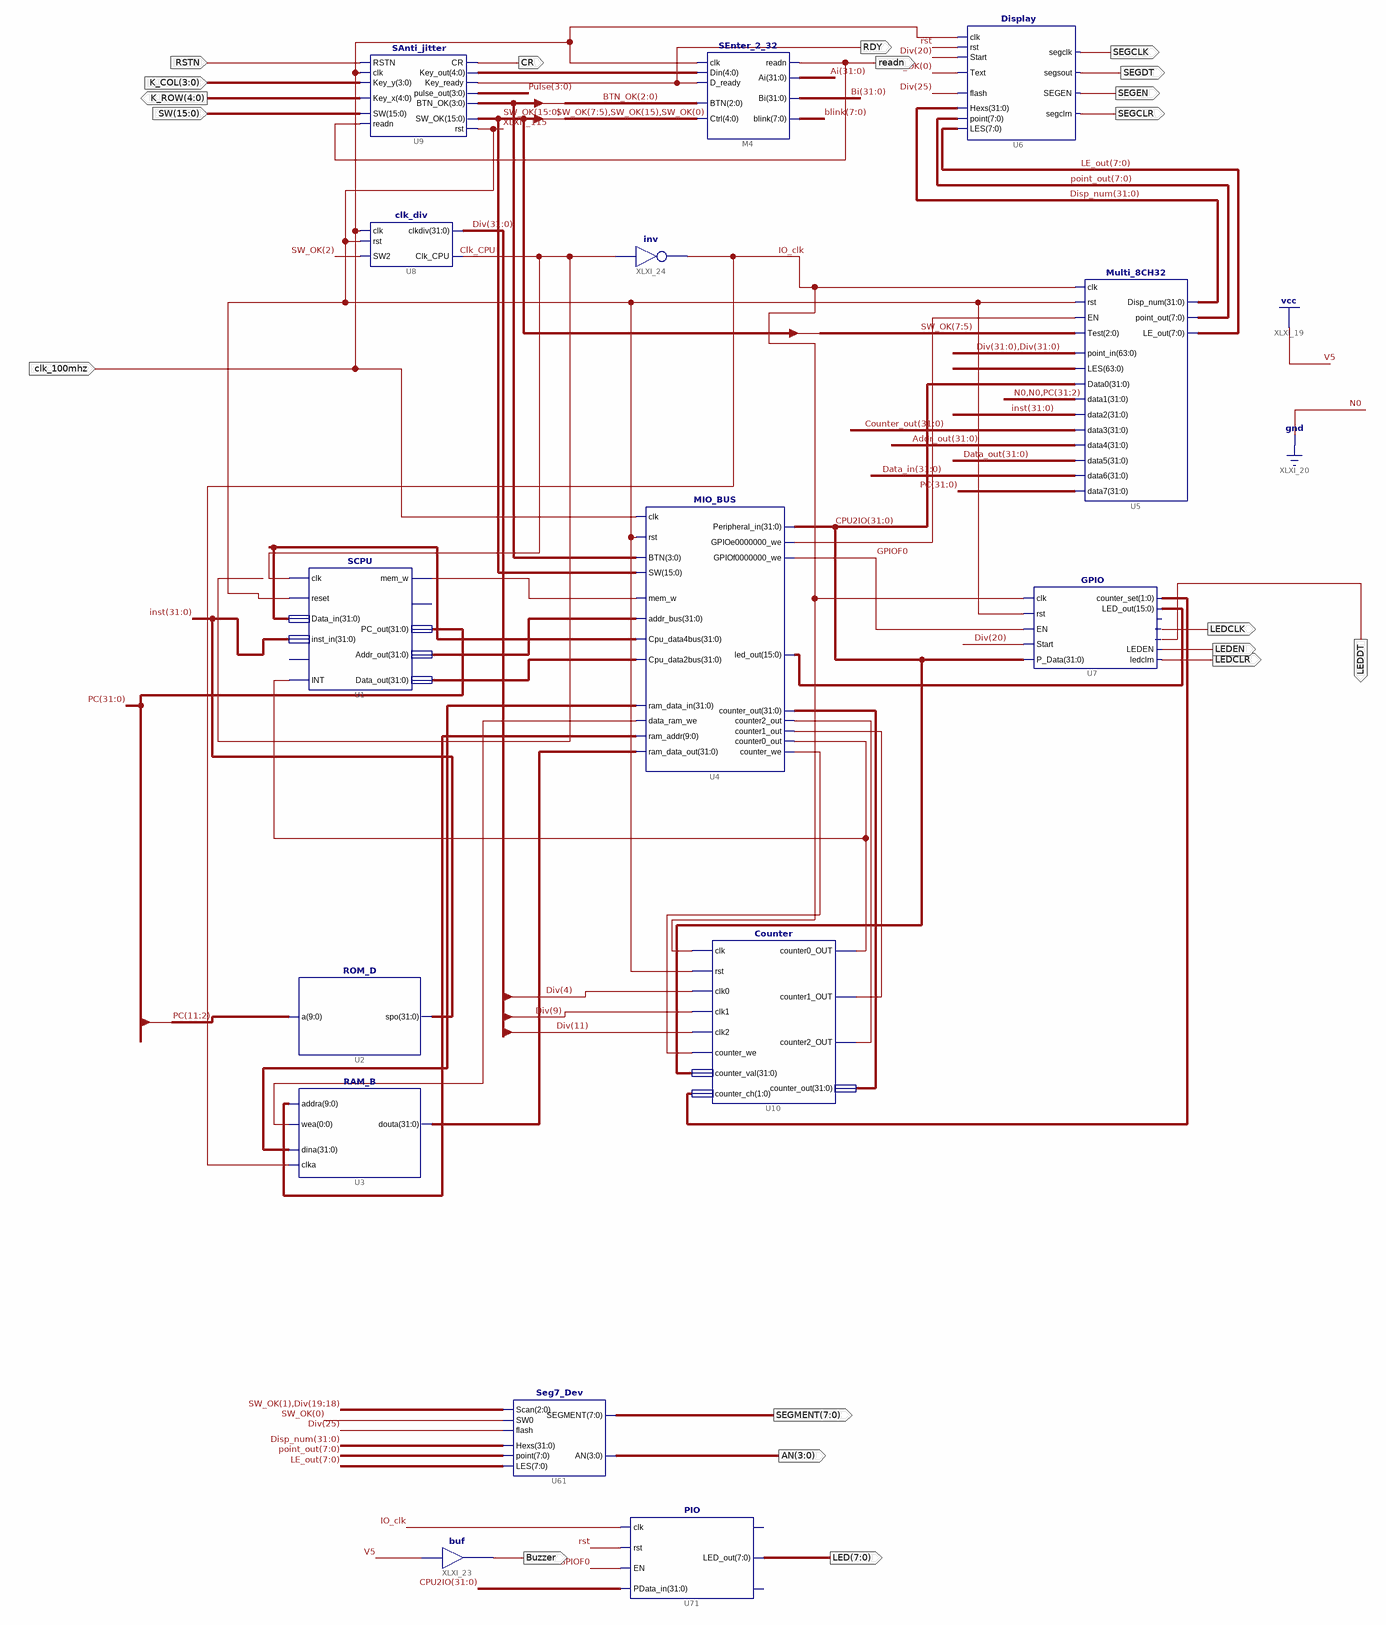
[diagram p0: schematic sheet 1]
// Xilinx ISE schematic OExp04_IP2CPU.sch (kintex7) as structural Verilog: 15 symbols, 20 ports
module OExp04_IP2CPU (
  input  RSTN,
  input  [3:0] K_COL,
  input  [15:0] SW,
  input  clk_100mhz,
  output [4:0] K_ROW,
  output readn,
  output CR,
  output RDY,
  output LEDCLR,
  output LEDEN,
  output [7:0] SEGMENT,
  output [3:0] AN,
  output Buzzer,
  output [7:0] LED,
  output LEDCLK,
  output LEDDT,
  output SEGCLK,
  output SEGDT,
  output SEGEN,
  output SEGCLR
);

  wire Clk_CPU, GPIOF0, IO_clk, rst, XLXN_65, XLXN_66, XLXN_68, XLXN_74, XLXN_109, XLXN_112, XLXN_115;
  wire [0:0] XLXN_98;
  wire [1:0] XLXN_78;
  wire [3:0] BTN_OK, Pulse;
  wire [4:0] XLXN_15;
  wire [7:0] blink, LE_out, point_out;
  wire [9:0] XLXN_99;
  wire [15:0] SW_OK, XLXN_79;
  wire [31:0] Addr_out, Ai, Bi, Counter_out, CPU2IO, Data_in, Data_out, Disp_num, Div, inst, PC, XLXN_58,
       XLXN_63, XLXN_97, XLXN_106, XLXN_107, XLXN_108;

  Multi_8CH32 U5 (
    .Test(SW_OK[7:5]), .point_in({Div, Div}), .EN(XLXN_74), .clk(IO_clk), .rst(XLXN_115), .LES({64{1'b0}}),
    .Data0(CPU2IO), .data1({2'b00, PC[31:2]}), .data2(inst), .data3(Counter_out), .data4(Addr_out),
    .data5(Data_out), .data6(Data_in), .data7(PC), .point_out(point_out), .LE_out(LE_out), .Disp_num(Disp_num));
  SEnter_2_32 #(.VeriModel("SEnter_2_32")) M4 (
    .readn(readn), .Ai(Ai), .Bi(Bi), .blink(blink), .Din(XLXN_15), .D_ready(RDY), .clk(clk_100mhz),
    .Ctrl({SW_OK[7:5], SW_OK[15], SW_OK[0]}), .BTN(BTN_OK[2:0]));
  SAnti_jitter #(.VeriModel("SAnti_jitter")) U9 (
    .SW(SW), .readn(readn), .Key_y(K_COL), .Key_x(K_ROW), .RSTN(RSTN), .clk(clk_100mhz), .Key_out(XLXN_15),
    .Key_ready(RDY), .CR(CR), .rst(XLXN_115), .SW_OK(SW_OK), .pulse_out(Pulse), .BTN_OK(BTN_OK));
  clk_div U8 (.rst(XLXN_115), .clk(clk_100mhz), .SW2(SW_OK[2]), .clkdiv(Div), .Clk_CPU(Clk_CPU));
  Display U6 (
    .LES(LE_out), .SEGEN(SEGEN), .segsout(SEGDT), .segclrn(SEGCLR), .point(point_out), .Hexs(Disp_num),
    .Text(SW_OK[0]), .flash(Div[25]), .segclk(SEGCLK), .clk(clk_100mhz), .rst(rst), .Start(Div[20]));
  GPIO U7 (
    .clk(IO_clk), .P_Data(CPU2IO), .rst(XLXN_115), .EN(GPIOF0), .Start(Div[20]), .ledclk(LEDCLK),
    .LED_out(XLXN_79), .counter_set(XLXN_78), .ledclrn(LEDCLR), .LEDEN(LEDEN), .ledsout(LEDDT));  // open: GPIOf0
  Seg7_Dev U61 (
    .LES(LE_out), .Scan({SW_OK[1], Div[19:18]}), .SEGMENT(SEGMENT), .AN(AN), .point(point_out),
    .flash(Div[25]), .SW0(SW_OK[0]), .Hexs(Disp_num));
  buf XLXI_23 (Buzzer, 1'b1);
  PIO U71 (.clk(IO_clk), .rst(rst), .EN(GPIOF0), .PData_in(CPU2IO), .LED_out(LED));  // open: GPIOf0, counter_set
  RAM_B U3 (.addra(XLXN_99), .clka(IO_clk), .wea(XLXN_98[0]), .dina(XLXN_97), .douta(XLXN_58));
  ROM_D U2 (.a(PC[11:2]), .spo(inst));
  Counter U10 (
    .clk(IO_clk), .rst(XLXN_115), .clk0(Div[4]), .clk1(Div[9]), .clk2(Div[11]), .counter_we(XLXN_68),
    .counter_val(CPU2IO), .counter_ch(XLXN_78), .counter0_OUT(XLXN_109), .counter1_OUT(XLXN_66),
    .counter2_OUT(XLXN_65), .counter_out(XLXN_63));
  MIO_BUS U4 (
    .rst(XLXN_115), .clk(clk_100mhz), .mem_w(XLXN_112), .addr_bus(XLXN_108), .Cpu_data4bus(XLXN_106),
    .Cpu_data2bus(XLXN_107), .ram_data_out(XLXN_58), .ram_addr(XLXN_99), .data_ram_we(XLXN_98[0]),
    .ram_data_in(XLXN_97), .counter_out(XLXN_63), .counter2_out(XLXN_65), .counter1_out(XLXN_66),
    .counter0_out(XLXN_109), .counter_we(XLXN_68), .BTN(BTN_OK), .SW(SW_OK), .led_out(XLXN_79),
    .Peripheral_in(CPU2IO), .GPIOe0000000_we(XLXN_74), .GPIOf0000000_we(GPIOF0));
  SCPU U1 (
    .clk(Clk_CPU), .reset(XLXN_115), .Data_in(XLXN_106), .inst_in(inst), .INT(XLXN_109), .mem_w(XLXN_112),
    .PC_out(PC), .Addr_out(XLXN_108), .Data_out(XLXN_107));  // open: MIO_ready, CPU_MIO
  not XLXI_24 (IO_clk, Clk_CPU);
endmodule
